# Altium project SmartPower.PrjPcb (part 1 of 2)
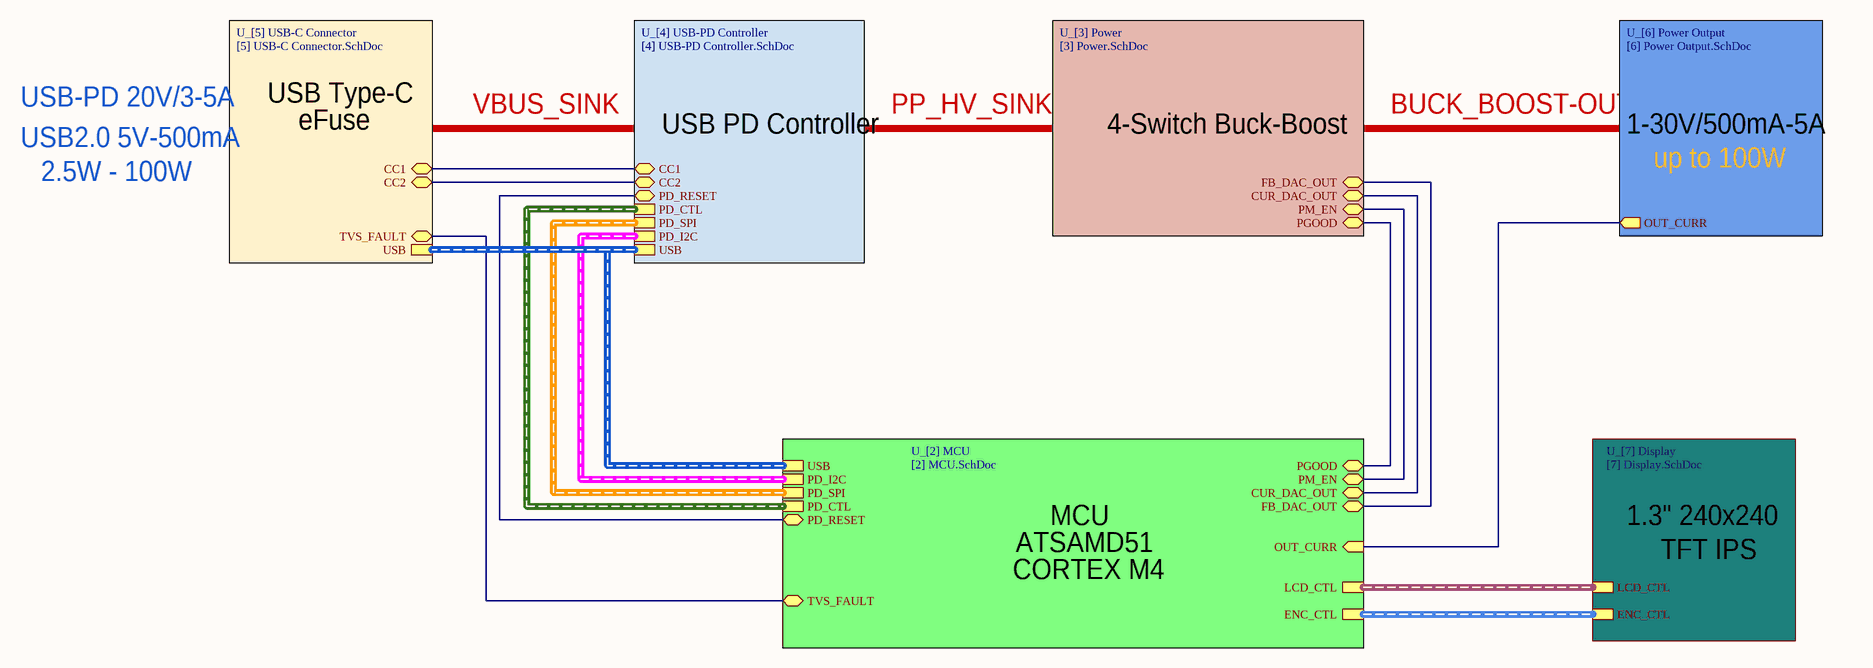
[diagram p0: [1] Block Diagram.SchDoc]
7 sheets, 117 parts. Net scope: hierarchical (ports join the sheet entries above them; power ports are global).
Board file: SmartPower.PcbDoc
Sheets:
  [1] Block Diagram.SchDoc
    U_[2] MCU = [2] MCU.SchDoc
    U_[5] USB-C Connector = [5] USB-C Connector.SchDoc
    U_[7] Display = [7] Display.SchDoc
    U_[4] USB-PD Controller = [4] USB-PD Controller.SchDoc
    U_[3] Power = [3] Power.SchDoc
    U_[6] Power Output = [6] Power Output.SchDoc

## Sheet [1] Block Diagram.SchDoc: Block Diagram - SmartPower
size A3; Author: Caner ALP; Organization: ALP Electronics; Address1: Axel Oxenstiernas; Address2: Västerås; Address3: 72478; Address4: Sweden; DocumentNumber: 1; Revision: P0.1; SheetNumber: 1; SheetTotal: 7

### Sub-sheets
U_[2] MCU = [2] MCU.SchDoc: PM_EN (bidir), CUR_DAC_OUT (bidir), PD_I2C (harness PD_I2C_H), USB (harness USB_H), PGOOD (bidir), PD_RESET (bidir), PD_CTL (harness PD_H), TVS_FAULT (bidir), FB_DAC_OUT (bidir), PD_SPI (harness PD_SPI_H), ENC_CTL (harness ENCODER), LCD_CTL (harness LCD), OUT_CURR (in)
U_[3] Power = [3] Power.SchDoc: FB_DAC_OUT (bidir), CUR_DAC_OUT (bidir), PM_EN (bidir), PGOOD (bidir)
U_[4] USB-PD Controller = [4] USB-PD Controller.SchDoc: PD_RESET (bidir), PD_CTL (harness PD_H), PD_SPI (harness PD_SPI_H), USB (harness USB_H), PD_I2C (harness PD_I2C_H), CC2 (bidir), CC1 (bidir)
U_[5] USB-C Connector = [5] USB-C Connector.SchDoc: USB (harness USB_H), TVS_FAULT (bidir), CC1 (bidir), CC2 (bidir)
U_[6] Power Output = [6] Power Output.SchDoc: OUT_CURR (out)
U_[7] Display = [7] Display.SchDoc: LCD_CTL (harness LCD), ENC_CTL (harness ENCODER)

### Nets
CC1: sheet U_[5] USB-C Connector/CC1, sheet U_[4] USB-PD Controller/CC1
CC2: sheet U_[5] USB-C Connector/CC2, sheet U_[4] USB-PD Controller/CC2
CUR_DAC_OUT: sheet U_[2] MCU/CUR_DAC_OUT, sheet U_[3] Power/CUR_DAC_OUT
FB_DAC_OUT: sheet U_[2] MCU/FB_DAC_OUT, sheet U_[3] Power/FB_DAC_OUT
OUT_CURR: sheet U_[2] MCU/OUT_CURR, sheet U_[6] Power Output/OUT_CURR
PD_RESET: sheet U_[2] MCU/PD_RESET, sheet U_[4] USB-PD Controller/PD_RESET
PGOOD: sheet U_[2] MCU/PGOOD, sheet U_[3] Power/PGOOD
PM_EN: sheet U_[2] MCU/PM_EN, sheet U_[3] Power/PM_EN
TVS_FAULT: sheet U_[2] MCU/TVS_FAULT, sheet U_[5] USB-C Connector/TVS_FAULT

### Buses and harness runs
harness sheet U_[2] MCU/ENC_CTL = sheet U_[7] Display/ENC_CTL
harness sheet U_[2] MCU/LCD_CTL = sheet U_[7] Display/LCD_CTL
harness sheet U_[2] MCU/PD_CTL = sheet U_[4] USB-PD Controller/PD_CTL
harness sheet U_[2] MCU/PD_I2C = sheet U_[4] USB-PD Controller/PD_I2C
harness sheet U_[2] MCU/PD_SPI = sheet U_[4] USB-PD Controller/PD_SPI
harness sheet U_[2] MCU/USB = sheet U_[4] USB-PD Controller/USB = sheet U_[5] USB-C Connector/USB

### Notes on the sheet
- USB-PD 20V/3-5A
- USB Type-C
- VBUS_SINK
- PP_HV_SINK
- BUCK_BOOST-OUT
- USB2.0 5V-500mA
- 2.5W - 100W
- eFuse
- USB PD Controller
- 4-Switch Buck-Boost
- 1-30V/500mA-5A
- up to 100W
- MCU
- 1.3" 240x240
- CORTEX M4
- ATSAMD51
- TFT IPS
- Title
- Size:
- Project
- A3
- Revision:
- Date:
- Sheet
- of

## Sheet [2] MCU.SchDoc
size A3; Author: Caner ALP; Organization: ALP Electronics; Address1: Axel Oxenstiernas; Address2: Västerås; Address3: 72478; Address4: Sweden; DocumentNumber: 2; SheetNumber: 2; SheetTotal: 7
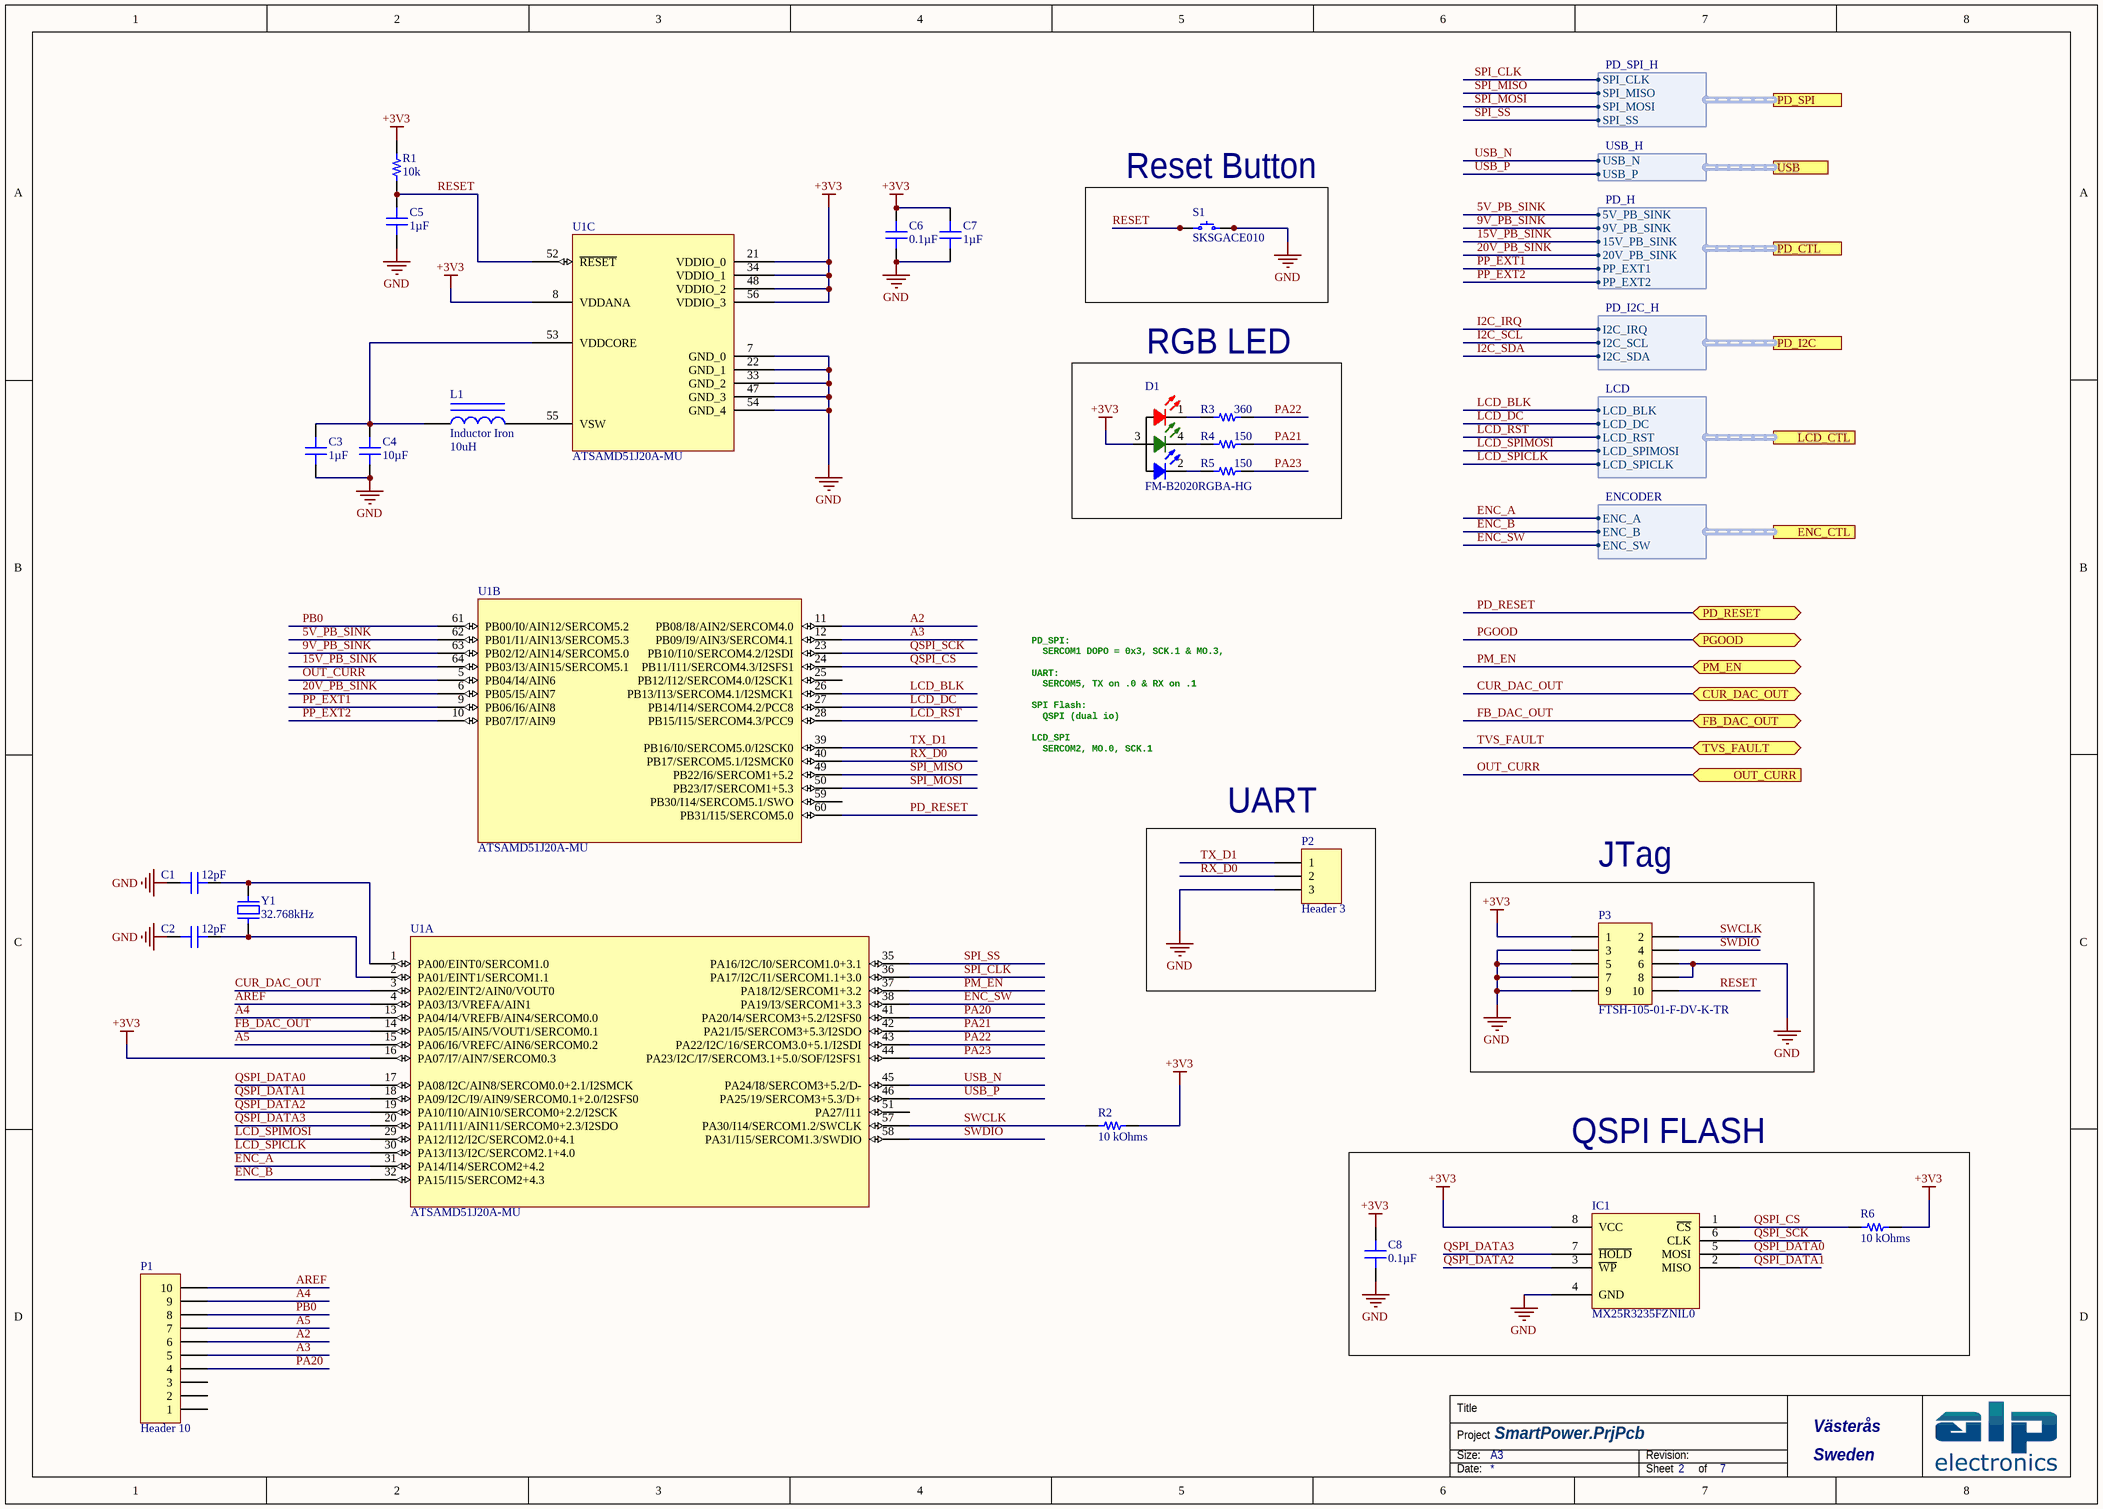
[diagram p1: [2] MCU.SchDoc]

### Parts
C1  12pF  [CAP 0603_1608]
C2  12pF  [CAP 0603_1608]
C3  1µF  [CAP 0603_1608]
C4  10µF  [CAP 0603_1608]
C5  1µF  [CAP 0603_1608]
C6  0.1µF  [CAP 0603_1608]
C7  1µF  [CAP 0603_1608]
C8  0.1µF  [CAP 0603_1608]
D1  FM-B2020RGBA-HG  [FM-B2020RGBA-HG]
IC1  MX25R3235FZNIL0  [SPANSION WSON-8 6x5MM]
L1  Inductor Iron  value 10uH  [IND_Würth_74404020100]
P1  Header 10  [HDR1X10]
P2  Header 3  [HDR1X3]
P3  FTSH-105-01-F-DV-K-TR  [FTSH-105-01-F-DV-K-TR]
R1  10k  [RES 0603/1608]
R2  10 kOhms  [RES 0603_1608]
R3  360  [RES 0603/1608]
R4  150  [RES 0603/1608]
R5  150  [RES 0603/1608]
R6  10 kOhms  [RES 0603_1608]
S1  SKSGACE010  [SKSGACE010]
U1  ATSAMD51J20A-MU  [SI LABS QFN-64_S]  (parts A,B,C of 3)
Y1  32.768kHz  [ABRACON ABS07]

### Blocks framed on the sheet
Reset Button: S1
RGB LED: D1 R3-R5
UART: P2
JTag: P3
QSPI FLASH: C8 IC1 R6

### Ports
CUR_DAC_OUT (bidir), ENC_CTL (harness ENCODER), FB_DAC_OUT (bidir), LCD_CTL (harness LCD), OUT_CURR (in), PD_CTL (harness PD_H), PD_I2C (harness PD_I2C_H), PD_RESET (bidir), PD_SPI (harness PD_SPI_H), PGOOD (bidir), PM_EN (bidir), TVS_FAULT (bidir), USB (harness USB_H)

### Harnesses
USB_H: USB_N, USB_P
PD_H: 5V_PB_SINK, 9V_PB_SINK, 15V_PB_SINK, 20V_PB_SINK, PP_EXT1, PP_EXT2
PD_SPI_H: SPI_CLK, SPI_MISO, SPI_MOSI, SPI_SS
PD_I2C_H: I2C_IRQ, I2C_SCL, I2C_SDA
LCD: LCD_BLK, LCD_DC, LCD_RST, LCD_SPIMOSI, LCD_SPICLK
ENCODER: ENC_A, ENC_B, ENC_SW

### Nets
+3V3: C6.1 C7.2 C8.1 D1.3 IC1.8(VCC) P3.1 R1.2 R2.2 R6.2 U1.8(VDDANA) U1.16(PA07/I7/AIN7/SERCOM0.3) U1.21(VDDIO_0) U1.34(VDDIO_1) U1.48(VDDIO_2) U1.56(VDDIO_3)
GND: C1.1 C2.1 C3.1 C4.1 C5.1 C6.2 C7.1 C8.2 IC1.4(GND) P2.3 P3.3 P3.5 P3.6 P3.7 P3.8 P3.9 S1.3 S1.4 U1.7(GND_0) U1.22(GND_1) U1.33(GND_2) U1.47(GND_3) U1.54(GND_4)
5V_PB_SINK: U1.62(PB01/I1/AIN13/SERCOM5.3) ; port PD_CTL.5V_PB_SINK
9V_PB_SINK: U1.63(PB02/I2/AIN14/SERCOM5.0) ; port PD_CTL.9V_PB_SINK
15V_PB_SINK: U1.64(PB03/I3/AIN15/SERCOM5.1) ; port PD_CTL.15V_PB_SINK
20V_PB_SINK: U1.6(PB05/I5/AIN7) ; port PD_CTL.20V_PB_SINK
A2: P1.6 U1.11(PB08/I8/AIN2/SERCOM4.0)
A3: P1.5 U1.12(PB09/I9/AIN3/SERCOM4.1)
A4: P1.9 U1.13(PA04/I4/VREFB/AIN4/SERCOM0.0)
A5: P1.7 U1.15(PA06/I6/VREFC/AIN6/SERCOM0.2)
AREF: P1.10 U1.4(PA03/I3/VREFA/AIN1)
CUR_DAC_OUT: U1.3(PA02/EINT2/AIN0/VOUT0) ; port CUR_DAC_OUT
ENC_A: U1.31(PA14/I14/SERCOM2+4.2) ; port ENC_CTL.ENC_A
ENC_B: U1.32(PA15/I15/SERCOM2+4.3) ; port ENC_CTL.ENC_B
ENC_SW: U1.38(PA19/I3/SERCOM1+3.3) ; port ENC_CTL.ENC_SW
FB_DAC_OUT: U1.14(PA05/I5/AIN5/VOUT1/SERCOM0.1) ; port FB_DAC_OUT
LCD_BLK: U1.26(PB13/I13/SERCOM4.1/I2SMCK1) ; port LCD_CTL.LCD_BLK
LCD_DC: U1.27(PB14/I14/SERCOM4.2/PCC8) ; port LCD_CTL.LCD_DC
LCD_RST: U1.28(PB15/I15/SERCOM4.3/PCC9) ; port LCD_CTL.LCD_RST
LCD_SPICLK: U1.30(PA13/I13/I2C/SERCOM2.1+4.0) ; port LCD_CTL.LCD_SPICLK
LCD_SPIMOSI: U1.29(PA12/I12/I2C/SERCOM2.0+4.1) ; port LCD_CTL.LCD_SPIMOSI
OUT_CURR: U1.5(PB04/I4/AIN6) ; port OUT_CURR
PA20: P1.4 U1.41(PA20/I4/SERCOM3+5.2/I2SFS0)
PA21: R4.2 U1.42(PA21/I5/SERCOM3+5.3/I2SDO)
PA22: R3.2 U1.43(PA22/I2C/16/SERCOM3.0+5.1/I2SDI)
PA23: R5.2 U1.44(PA23/I2C/I7/SERCOM3.1+5.0/SOF/I2SFS1)
PB0: P1.8 U1.61(PB00/I0/AIN12/SERCOM5.2)
PD_RESET: U1.60(PB31/I15/SERCOM5.0) ; port PD_RESET
PM_EN: U1.37(PA18/I2/SERCOM1+3.2) ; port PM_EN
PP_EXT1: U1.9(PB06/I6/AIN8) ; port PD_CTL.PP_EXT1
PP_EXT2: U1.10(PB07/I7/AIN9) ; port PD_CTL.PP_EXT2
QSPI_CS: IC1.1(~{CS}) R6.1 U1.24(PB11/I11/SERCOM4.3/I2SFS1)
QSPI_DATA0: IC1.5(MOSI) U1.17(PA08/I2C/AIN8/SERCOM0.0+2.1/I2SMCK)
QSPI_DATA1: IC1.2(MISO) U1.18(PA09/I2C/I9/AIN9/SERCOM0.1+2.0/I2SFS0)
QSPI_DATA2: IC1.3(~{WP}) U1.19(PA10/I10/AIN10/SERCOM0+2.2/I2SCK)
QSPI_DATA3: IC1.7(~{HOLD}) U1.20(PA11/I11/AIN11/SERCOM0+2.3/I2SDO)
QSPI_SCK: IC1.6(CLK) U1.23(PB10/I10/SERCOM4.2/I2SDI)
RESET: C5.2 P3.10 R1.1 S1.1 S1.2 U1.52(~{RESET})
RX_D0: P2.2 U1.40(PB17/SERCOM5.1/I2SMCK0)
SPI_CLK: U1.36(PA17/I2C/I1/SERCOM1.1+3.0) ; port PD_SPI.SPI_CLK
SPI_MISO: U1.49(PB22/I6/SERCOM1+5.2) ; port PD_SPI.SPI_MISO
SPI_MOSI: U1.50(PB23/I7/SERCOM1+5.3) ; port PD_SPI.SPI_MOSI
SPI_SS: U1.35(PA16/I2C/I0/SERCOM1.0+3.1) ; port PD_SPI.SPI_SS
SWCLK: P3.2 R2.1 U1.57(PA30/I14/SERCOM1.2/SWCLK)
SWDIO: P3.4 U1.58(PA31/I15/SERCOM1.3/SWDIO)
TX_D1: P2.1 U1.39(PB16/I0/SERCOM5.0/I2SCK0)
USB_N: U1.45(PA24/I8/SERCOM3+5.2/D-) ; port USB.USB_N
USB_P: U1.46(PA25/19/SERCOM3+5.3/D+) ; port USB.USB_P
NetC1_2: C1.2 U1.1(PA00/EINT0/SERCOM1.0) Y1.2
NetC2_2: C2.2 U1.2(PA01/EINT1/SERCOM1.1) Y1.1
NetC3_2: C3.2 C4.2 L1.1 U1.53(VDDCORE)
NetD1_1: D1.1 R3.1
NetD1_2: D1.2 R5.1
NetD1_4: D1.4 R4.1
NetL1_2: L1.2 U1.55(VSW)

Not connected (* = marked no-connect by the designer): P1 1 2 3; U1 25(PB12/I12/SERCOM4.0/I2SCK1) 51(PA27/I11) 59(PB30/I14/SERCOM5.1/SWO)

### Notes on the sheet
- PD_SPI:
  SERCOM1 DOPO = 0x3, SCK.1 & MO.3,
  UART:
  SERCOM5, TX on .0 & RX on .1
  SPI Flash:
  QSPI (dual io)
  LCD_SPI
  SERCOM2, MO.0, SCK.1
- Title
- Size:
- Project
- A3
- Revision:
- Date:
- Sheet
- of

### Library data of the parts
C1 C2 = 06031A120JAT4A: CAP CER 12PF 100V NP0 0603; Manufacturer: AVX Corporation; Temperature Coefficient: C0G, NP0; Tolerance: ±5%; Part Number: 06031A120JAT4A; Value: 12pF; Applications: General Purpose; Capacitance: 12pF; ComponentLink1Description: Datasheet; ComponentLink1URL: http://datasheets.avx.com/C0GNP0-Dielectric.pdf; ComponentLink2Description: DigiKey Link; ComponentLink2URL: http://digikey.com/product-detail/en/avx-corporation/06031A120JAT4A/478-10188-1-ND/6797488; Device Package: 0603 (1608 Metric); LastUpdated: 21/01/2020 00:01:49; Lifecycle Status: Active; Minimum Order: 1; Mounting Type: Surface Mount, MLCC; Operating Temperature: -55°C ~ 125°C; Package / Case: 0603 (1608 Metric); Packaging: TapeAndReel; PartId: 14161; Part Status: Active; Price: 0.01; Series: -; Size / Dimension: 0.063" L x 0.032" W (1.60mm x 0.81mm); Supplier 1: DigiKey; Supplier Part Number 1: 478-10188-1-ND; Thickness (Max): 0.035" (0.90mm); Voltage - Rated: 100V
C3 C5 = 06035C105KAT2A: CAP CER 1UF 50V X7R 0603; Manufacturer: AVX Corporation; Tolerance: ±10%; Part Number: 06035C105KAT2A; Value: 1µF; Applications: General Purpose; Capacitance: 1µF; ComponentLink1Description: Datasheet; ComponentLink1URL: http://datasheets.avx.com/X7RDielectric.pdf; ComponentLink2Description: DigiKey Link; ComponentLink2URL: http://digikey.com/product-detail/en/avx-corporation/06035C105KAT2A/478-10073-1-ND/6564295; Device Package: 0603 (1608 Metric); LastUpdated: 21/01/2020 00:02:08; Lifecycle Status: Active; Minimum Order: 1; Mounting Type: Surface Mount, MLCC; Operating Temperature: -55°C ~ 125°C; Package / Case: 0603 (1608 Metric); Packaging: TapeAndReel; PartId: 2905; Part Status: Active; Price: 0.15; Series: -; Size / Dimension: 0.063" L x 0.032" W (1.60mm x 0.81mm); Supplier 1: DigiKey; Supplier Part Number 1: 478-10073-1-ND; Temperature Coefficient: X7R; Thickness (Max): 0.020" (0.50mm); Voltage - Rated: 50V
C4 = 0603ZD106MAT2A: CAP CER 10UF 10V X5R 0603; Manufacturer: AVX Corporation; Tolerance: ±20%; Part Number: 0603ZD106MAT2A; Value: 10µF; Applications: General Purpose; Capacitance: 10µF; ComponentLink1Description: Datasheet; ComponentLink1URL: http://datasheets.avx.com/cx5r.pdf; ComponentLink2Description: DigiKey Link; ComponentLink2URL: http://digikey.com/product-detail/en/avx-corporation/0603ZD106MAT2A/478-8050-1-ND/3900666; Device Package: 0603 (1608 Metric); LastUpdated: 21/01/2020 00:01:55; Lifecycle Status: Active; Minimum Order: 1; Mounting Type: Surface Mount, MLCC; Operating Temperature: -55°C ~ 85°C; Package / Case: 0603 (1608 Metric); Packaging: TapeAndReel; PartId: 11464; Part Status: Active; Price: 0.18; Series: -; Size / Dimension: 0.063" L x 0.032" W (1.60mm x 0.81mm); Supplier 1: DigiKey; Supplier Part Number 1: 478-8050-1-ND; Temperature Coefficient: X5R; Thickness (Max): 0.035" (0.90mm); Voltage - Rated: 10V
C6 C8 = 0603BB104K500NGT: CAP CER 0.1UF 50V X7R 0603; Manufacturer: Knowles Novacap; Tolerance: ±10%; Part Number: 0603BB104K500NGT; Value: 0.1µF; Applications: General Purpose; Capacitance: 0.1µF; ComponentLink1Description: Datasheet; ComponentLink1URL: https://www.knowlescapacitors.com/getattachment/6c8d48ef-fc2b-4752-ae2c-ce6c208de0c4/High-Capacitance-Chip.aspx; ComponentLink2Description: DigiKey Link; ComponentLink2URL: http://digikey.com/product-detail/en/knowles-novacap/0603BB104K500NGT/1763-1146-1-ND/7304094; Device Package: 0603 (1608 Metric); Features: Gold Flash Termination; LastUpdated: 21/01/2020 00:02:02; Lifecycle Status: Active; Minimum Order: 1; Mounting Type: Surface Mount, MLCC; Operating Temperature: -55°C ~ 125°C; Package / Case: 0603 (1608 Metric); Packaging: TapeAndReel; PartId: 7006; Part Status: Active; Price: 0.56; Series: -; Size / Dimension: 0.060" L x 0.030" W (1.52mm x 0.76mm); Supplier 1: DigiKey; Supplier Part Number 1: 1763-1146-1-ND; Temperature Coefficient: X7R; Thickness (Max): 0.035" (0.89mm); Voltage - Rated: 50V
C7 = 0603BB105K160YT: CAP CER 1UF 16V X7R 0603; Manufacturer: Knowles Novacap; Tolerance: ±10%; Part Number: 0603BB105K160YT; Value: 1µF; Applications: General Purpose; Capacitance: 1µF; ComponentLink1Description: Datasheet; ComponentLink1URL: https://www.knowlescapacitors.com/getattachment/6c8d48ef-fc2b-4752-ae2c-ce6c208de0c4/High-Capacitance-Chip.aspx; ComponentLink2Description: DigiKey Link; ComponentLink2URL: http://digikey.com/product-detail/en/knowles-novacap/0603BB105K160YT/1763-1175-1-ND/7304294; Device Package: 0603 (1608 Metric); LastUpdated: 21/01/2020 00:02:02; Lifecycle Status: Active; Minimum Order: 1; Mounting Type: Surface Mount, MLCC; Operating Temperature: -55°C ~ 125°C; Package / Case: 0603 (1608 Metric); Packaging: TapeAndReel; PartId: 6996; Part Status: Active; Price: 0.51; Series: -; Size / Dimension: 0.060" L x 0.030" W (1.52mm x 0.76mm); Supplier 1: DigiKey; Supplier Part Number 1: 1763-1175-1-ND; Temperature Coefficient: X7R; Thickness (Max): 0.035" (0.89mm); Voltage - Rated: 16V
D1 = FM-B2020RGBA-HG: RGB 615~630nmRed,515~535nmGreen,465~480nmBlue 2020; Manufacturer: Foshan NationStar Optoelectronics; Value: Green; Type: Surface Mount; Part Number: FM-B2020RGBA-HG; PartId: 10872; Supplier 1: LCSC; Supplier Part Number 1: C108793; ComponentLink1Description: Datasheet; ComponentLink1URL: https://datasheet.lcsc.com/szlcsc/1810231210_Foshan-NationStar-Optoelectronics-FM-B2020RGBA-HG_C108793.pdf; ComponentLink2Description: LCSC Listing; ComponentLink2URL: https://lcsc.com/product-detail/Light-Emitting-Diodes-LED_FM-B2020RGBA-HG_C108793.html; Device Package: 2020; Colour: RGB
IC1 = S25FL116K0XNFI011: IC FLASH MEM 16MB SPI CMOS 8WSON; Manufacturer: Spansion; Memory Type: FLASH - NOR; Memory Size: 16M (2M x 8); Speed: 108MHz; Interface: SPI Serial; Voltage - Supply: 2.7 V ~ 3.6 V; Part Number: S25FL116K0XNFI011; PartId: 8258; Supplier 1: Digi-Key; Supplier Part Number 1: 1274-1131-ND; ComponentLink1Description: Datasheet; ComponentLink1URL: http://www.spansion.com/Support/Datasheets/S25FL1-K_00.pdf; ComponentLink2Description: Digi-Key Listing; ComponentLink2URL: http://www.digikey.com/product-detail/en/S25FL116K0XNFI011/1274-1131-ND/4517162; Price: 0,49; Type: FLASH - NOR; Device Package: 8-WDFN Exposed Pad; Operating Temperature: -40C ~ 85C
L1 = Inductor Iron: Magnetic-Core Inductor; Published: 24-Mar-1999; LatestRevisionDate: 17-Jul-2002; LatestRevisionNote: Re-released for DXP Platform.; PackageReference: AXIAL-0.9; Publisher: Altium Limited; PackageDescription: Axial Device, Thru-Hole; 2 Leads; 0.9 in Pin Spacing
P1 = Header 10: Header, 10-Pin; LatestRevisionDate: 17-Jul-2002; LatestRevisionNote: Re-released for DXP Platform.; Publisher: Altium Limited
P2 = Header 3: Header, 3-Pin; LatestRevisionDate: 17-Jul-2002; LatestRevisionNote: Re-released for DXP Platform.; Publisher: Altium Limited
P3 = Header 5X2: Header, 5-Pin, Dual row; LatestRevisionDate: 17-Jul-2002; LatestRevisionNote: Re-released for DXP Platform.; Publisher: Altium Limited
R1 = ERJ-3GEYJ103V: RES SMD 10K OHM 5% 1/10W 0603; Manufacturer: Panasonic Electronic Components; TemperatureRange: -55C ~ 155C; TemperatureCoefficient: 200ppm/C; PowerRating: 0.1W, 1/10W; Value: 10k; Part Number: ERJ-3GEYJ103V; PartId: 11175; Supplier 1: Digi-Key; Supplier Part Number 1: P10KGTR-ND; ComponentLink1Description: Datasheet; ComponentLink1URL: http://industrial.panasonic.com/www-cgi/jvcr13pz.cgi?E+PZ+3+AOA0001+ERJ3GEYJ103V+7+WW; ComponentLink2Description: Digi-Key Listing; ComponentLink2URL: https://www.digikey.com/product-detail/en/panasonic-electronic-components/ERJ-3GEYJ103V/P10KGTR-ND/135662; Tolerance: 5%; Price: 0.002; Device Package: 0603 (1608 Metric)
R2 R6 = CRCW060310K0JNEA: RES SMD 10K OHM 5% 1/10W 0603; Manufacturer: Vishay Dale; Power (Watts): 0.1W, 1/10W; Temperature Coefficient: ±200ppm/°C; Part Number: CRCW060310K0JNEA; Value: 10 kOhms; ComponentLink1Description: Datasheet; ComponentLink1URL: http://www.vishay.com/docs/20035/dcrcwe3.pdf; ComponentLink2Description: DigiKey Link; ComponentLink2URL: http://digikey.com/product-detail/en/vishay-dale/CRCW060310K0JNEA/541-10KGCT-ND/1179393; Composition: Thick Film; Device Package: 0603 (1608 Metric); Features: Automotive AEC-Q200; Height - Seated (Max): 0.020" (0.50mm); LastUpdated: 21/01/2020 00:24:50; Lifecycle Status: Active; Minimum Order: 1; Number of Terminations: 2; Operating Temperature: -55°C ~ 155°C; Package / Case: 0603 (1608 Metric); Packaging: CutTape; PartId: 5216; Part Status: Active; Price: 0.10; Ratings: AEC-Q200; Resistance: 10 kOhms; Series: CRCW; Size / Dimension: 0.063" L x 0.033" W (1.60mm x 0.85mm); Supplier 1: DigiKey; Supplier Part Number 1: 541-10KGCT-ND; Supplier Device Package: 0603; Tolerance: ±5%
R3 = ERJ-3GEYJ361V: RES SMD 360 OHM 5% 1/10W 0603; Manufacturer: Panasonic Electronic Components; TemperatureRange: -55C ~ 155C; TemperatureCoefficient: 200ppm/C; PowerRating: 0.1W, 1/10W; Value: 360; Part Number: ERJ-3GEYJ361V; PartId: 11239; Supplier 1: Digi-Key; Supplier Part Number 1: P360GTR-ND; ComponentLink1Description: Datasheet; ComponentLink1URL: http://industrial.panasonic.com/www-cgi/jvcr13pz.cgi?E+PZ+3+AOA0001+ERJ3GEYJ361V+7+WW; ComponentLink2Description: Digi-Key Listing; ComponentLink2URL: https://www.digikey.com/product-detail/en/panasonic-electronic-components/ERJ-3GEYJ361V/P360GTR-ND/135761; Tolerance: 5%; Price: 0.002; Device Package: 0603 (1608 Metric)
R4 R5 = ERJ-3GEYJ151V: RES SMD 150 OHM 5% 1/10W 0603; Manufacturer: Panasonic Electronic Components; TemperatureRange: -55C ~ 155C; TemperatureCoefficient: 200ppm/C; PowerRating: 0.1W, 1/10W; Value: 150; Part Number: ERJ-3GEYJ151V; PartId: 11200; Supplier 1: Digi-Key; Supplier Part Number 1: P150GTR-ND; ComponentLink1Description: Datasheet; ComponentLink1URL: http://industrial.panasonic.com/www-cgi/jvcr13pz.cgi?E+PZ+3+AOA0001+ERJ3GEYJ151V+7+WW; ComponentLink2Description: Digi-Key Listing; ComponentLink2URL: https://www.digikey.com/product-detail/en/panasonic-electronic-components/ERJ-3GEYJ151V/P150GTR-ND/135689; Tolerance: 5%; Price: 0.002; Device Package: 0603 (1608 Metric)
S1 = SKSGACE010: SWITCH TACTILE SPST-NO 0.05A 16V; Manufacturer: ALPS; Part Number: SKSGACE010; PartId: 16471; Supplier 1: Mouser; Supplier Part Number 1: 688-SKSGACE010; ComponentLink1Description: Datasheet; ComponentLink1URL: https://www.mouser.se/datasheet/2/15/SKSG-1370727.pdf; ComponentLink2Description: Mouser Listing; ComponentLink2URL: https://www.mouser.se/ProductDetail/ALPS/SKSGACE010?qs=Ptl%2FSkKmb3BEFq%252BG855%2Fog==
U1 = ATSAMD51J20A-MU: IC MCU 32BIT 1MB FLASH 64VQFN; Manufacturer: Microchip Technology; Core Processor: ARM Cortex-M4; Part Number: ATSAMD51J20A-MU; PartId: 10980; Supplier 1: Digi-Key; Supplier Part Number 1: ATSAMD51J20A-MU-ND; ComponentLink1Description: Datasheet; ComponentLink1URL: http://ww1.microchip.com/downloads/en/DeviceDoc/60001507E.pdf; ComponentLink2Description: Digi-Key Listing; ComponentLink2URL: https://www.digikey.com/product-detail/en/microchip-technology/ATSAMD51J20A-MU/ATSAMD51J20A-MU-ND/7390352; Device Package: 64-VFQFN Exposed Pad
Y1 = ABS07-32.768KHZ-T: CRYSTAL 32.7680KHZ 12.5PF SMD; Manufacturer: Abracon LLC; Frequency Tolerance: 20ppm; ESR: 70 kOhm; Operating Mode: Fundamental; Part Number: ABS07-32.768KHZ-T; PartId: 8487; Supplier 1: Digi-Key; Supplier Part Number 1: 535-9542-2-ND; ComponentLink1Description: Datasheet; ComponentLink1URL: http://www.abracon.com/Resonators/ABS07.pdf; ComponentLink2Description: Digi-Key Listing; ComponentLink2URL: http://www.digikey.com/product-detail/en/ABS07-32.768KHZ-T/535-9542-2-ND/1236858; Price: 0,3; Type: kHz Crystal (Tuning Fork); Device Package: 2-SMD; Frequency: 32.768kHz; Frequency Stability: -; Load Capacitance: 12.5pF

## Sheet [5] USB-C Connector.SchDoc: Power IN - USB-C
size A3; Author: Caner ALP; CompanyName: ALP Electronics; DrawnBy: Caner Alp; Engineer: Caner Alp; Organization: ALP Electronics; Address1: Axel Oxenstiernas; Address2: Västerås; Address3: 72478; Address4: Sweden; DocumentNumber: 5; SheetNumber: 5; SheetTotal: 7
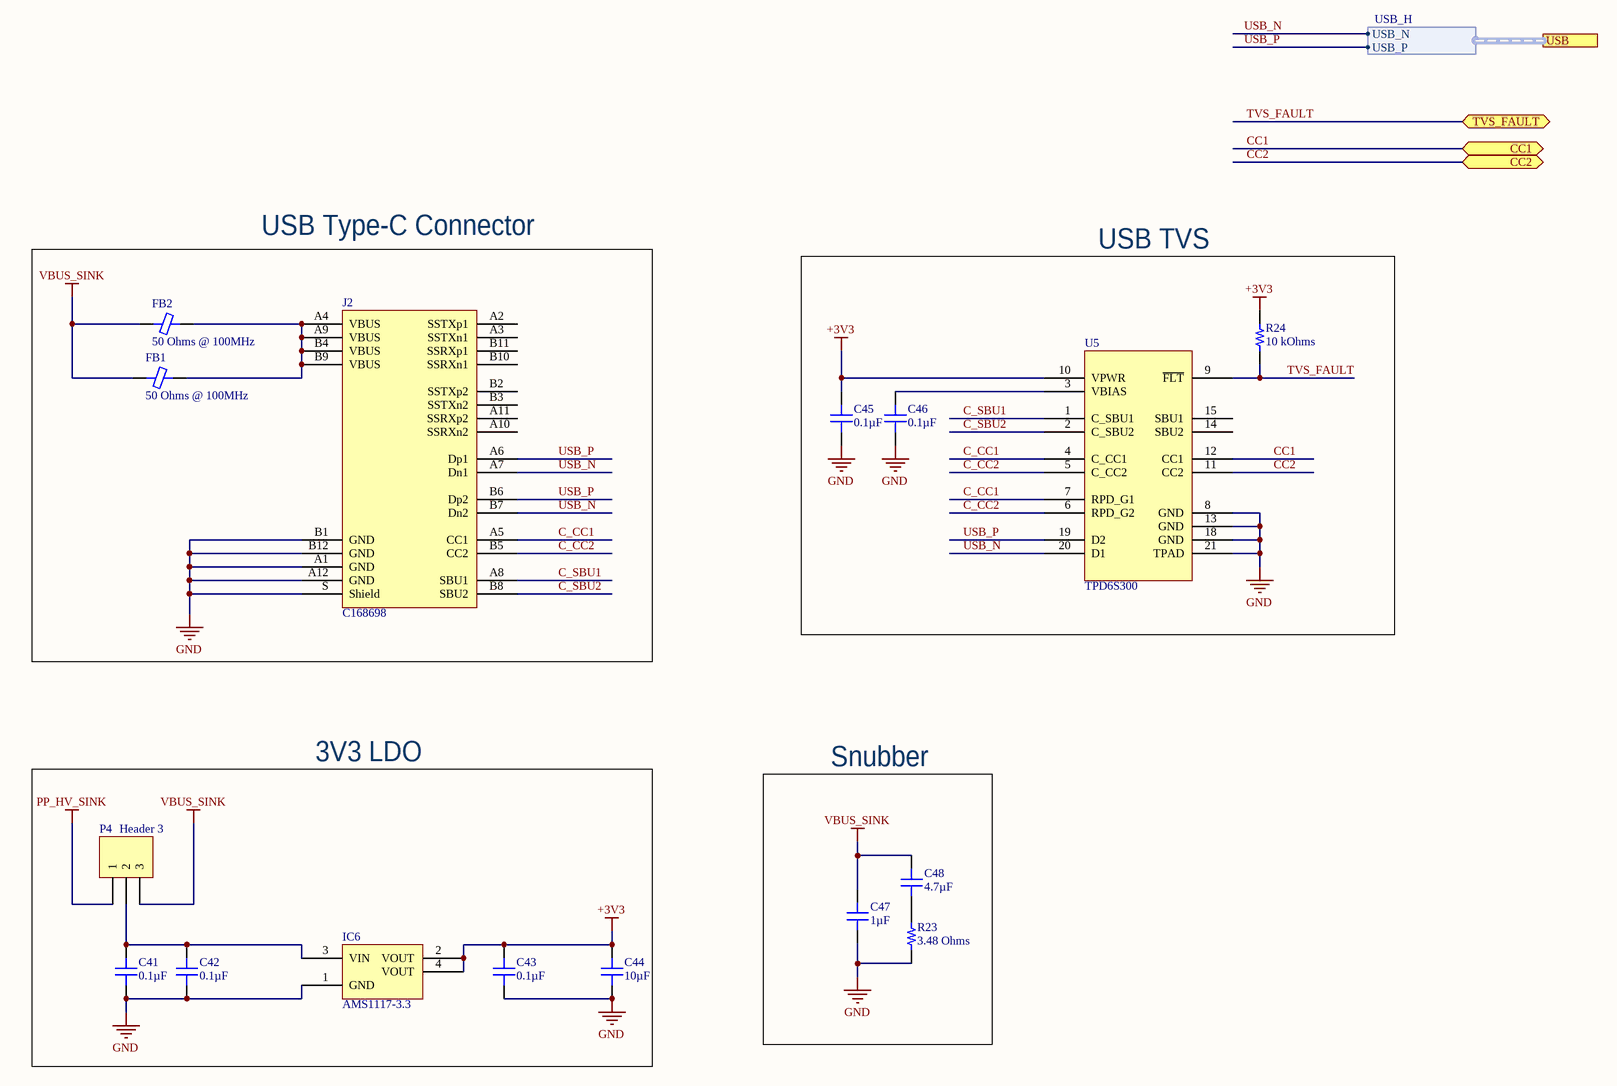
[diagram p2: [5] USB-C Connector.SchDoc]

### Parts
C41  0.1µF  [CAP 0805_2012]
C42  0.1µF  [CAP 0805_2012]
C43  0.1µF  [CAP 0805_2012]
C44  10µF  [CAP 1210_3225 - 2.8MM]
C45  0.1µF  [CAP 0603_1608]
C46  0.1µF  [CAP 0603_1608]
C47  1µF  [CAP 0805_2012]
C48  4.7µF  [CAP 0805_2012]
FB1  50 Ohms @ 100MHz  [FER 1206_3216]
FB2  50 Ohms @ 100MHz  [FER 1206_3216]
IC6  AMS1117-3.3  [ON SEMI SOT-223 ST(318H)]
J2  C168698  [USB4055]
P4  Header 3  [HEADER 2.54MM - duplicate1]
R23  3.48 Ohms  [RES 0805_2012]
R24  10 kOhms  [RES 0603_1608]
U5  TPD6S300  [WQFN - 20]

### Blocks framed on the sheet
USB Type-C Connector: FB1 FB2 J2
USB TVS: C45 C46 R24 U5
3V3 LDO: C41-C44 IC6 P4
Snubber: C47 C48 R23

### Ports
CC1 (bidir), CC2 (bidir), TVS_FAULT (bidir), USB (harness USB_H)

### Harnesses
USB_H: USB_N, USB_P

### Nets
+3V3: C43.2 C44.2 C45.2 IC6.2(VOUT) IC6.4(VOUT) R24.1 U5.10(VPWR)
GND: C41.1 C42.1 C43.1 C44.1 C45.1 C46.1 C47.1 IC6.1(GND) J2.A1(GND) J2.A12(GND) J2.B1(GND) J2.B12(GND) J2.S(Shield) R23.1 U5.8(GND) U5.13(GND) U5.18(GND) U5.21(TPAD)
PP_HV_SINK: P4.1
VBUS_SINK: C47.2 C48.1 FB1.1 FB2.1 P4.3
C_CC1: J2.A5(CC1) U5.4(C_CC1) U5.7(RPD_G1)
C_CC2: J2.B5(CC2) U5.5(C_CC2) U5.6(RPD_G2)
C_SBU1: J2.A8(SBU1) U5.1(C_SBU1)
C_SBU2: J2.B8(SBU2) U5.2(C_SBU2)
CC1: U5.12(CC1) ; port CC1
CC2: U5.11(CC2) ; port CC2
TVS_FAULT: R24.2 U5.9(~{FLT}) ; port TVS_FAULT
USB_N: J2.A7(Dn1) J2.B7(Dn2) U5.20(D1) ; port USB.USB_N
USB_P: J2.A6(Dp1) J2.B6(Dp2) U5.19(D2) ; port USB.USB_P
NetC41_2: C41.2 C42.2 IC6.3(VIN) P4.2
NetC46_2: C46.2 U5.3(VBIAS)
NetC48_2: C48.2 R23.2
NetFB1_2: FB1.2 FB2.2 J2.A4(VBUS) J2.A9(VBUS) J2.B4(VBUS) J2.B9(VBUS)

Not connected (* = marked no-connect by the designer): J2 A2(SSTXp1) A3(SSTXn1) A10(SSRXn2) A11(SSRXp2) B2(SSTXp2) B3(SSTXn2) B10(SSRXn1) B11(SSRXp1); U5 14(SBU2) 15(SBU1) 16(NC) 17(NC)

### Notes on the sheet
- Title
- Size:
- Project
- A3
- Revision:
- Date:
- Sheet
- of

### Library data of the parts
C41-C43 = 160R15W104KV4T: CAP CER 0.1UF 16V X7R 0805; Manufacturer: Johanson Dielectrics Inc.; Tolerance: ±10%; Part Number: 160R15W104KV4T; Value: 0.1µF; Applications: General Purpose; Capacitance: 0.1µF; ComponentLink1Description: Datasheet; ComponentLink1URL: https://www.johansondielectrics.com/downloads/catalog/johanson-dielectrics-product-catalog.pdf; ComponentLink2Description: DigiKey Link; ComponentLink2URL: http://digikey.com/product-detail/en/johanson-dielectrics-inc/160R15W104KV4T/709-1183-1-ND/1859515; Device Package: 0805 (2012 Metric); LastUpdated: 21/01/2020 00:02:56; Lifecycle Status: Active; Minimum Order: 1; Mounting Type: Surface Mount, MLCC; Operating Temperature: -55°C ~ 125°C; Package / Case: 0805 (2012 Metric); Packaging: TapeAndReel; PartId: 9125; Part Status: Active; Price: 0.03; Series: -; Size / Dimension: 0.080" L x 0.050" W (2.03mm x 1.27mm); Supplier 1: DigiKey; Supplier Part Number 1: 709-1183-1-ND; Temperature Coefficient: X7R; Thickness (Max): 0.050" (1.27mm); Voltage - Rated: 16V
C44 = C1210C106K3RACAUTO: CAP CER 10UF 25V X7R 1210; Manufacturer: KEMET; Tolerance: ±10%; Part Number: C1210C106K3RACAUTO; Value: 10µF; Applications: Automotive, Bypass, Decoupling; Capacitance: 10µF; ComponentLink1Description: Datasheet; ComponentLink1URL: //media.digikey.com/pdf/Data%20Sheets/Kemet%20PDFs/C1210C106K3RACAUTO.pdf; ComponentLink2Description: DigiKey Link; ComponentLink2URL: http://digikey.com/product-detail/en/kemet/C1210C106K3RACAUTO/399-7046-1-ND/3314553; Device Package: 1210 (3225 Metric); LastUpdated: 21/01/2020 00:30:50; Lifecycle Status: Active; Minimum Order: 1; Mounting Type: Surface Mount, MLCC; Operating Temperature: -55°C ~ 125°C; Package / Case: 1210 (3225 Metric); Packaging: TapeAndReel; PartId: 23626; Part Status: Active; Price: 0.22; Ratings: AEC-Q200; Series: SMD Auto X7R; Size / Dimension: 0.126" L x 0.098" W (3.20mm x 2.50mm); Supplier 1: DigiKey; Supplier Part Number 1: 399-7046-1-ND; Temperature Coefficient: X7R; Thickness (Max): 0.106" (2.70mm); Voltage - Rated: 25V
C45 C46 = 0603B104J160CT: CAP CER 0.1UF 16V X7R 0603; Manufacturer: Walsin Technology Corporation; Tolerance: ±5%; Part Number: 0603B104J160CT; Value: 0.1µF; Applications: General Purpose; Capacitance: 0.1µF; ComponentLink1Description: Datasheet; ComponentLink1URL: http://www.passivecomponent.com/wp-content/uploads/2018/10/MLCC.pdf; ComponentLink2Description: DigiKey Link; ComponentLink2URL: http://digikey.com/product-detail/en/walsin-technology-corporation/0603B104J160CT/1292-1389-1-ND/9355393; Device Package: 0603 (1608 Metric); LastUpdated: 21/01/2020 00:01:52; Lifecycle Status: Active; Minimum Order: 1; Mounting Type: Surface Mount, MLCC; Operating Temperature: -55°C ~ 125°C; Package / Case: 0603 (1608 Metric); Packaging: TapeAndReel; PartId: 13150; Part Status: Active; Price: 0.02; Series: -; Size / Dimension: 0.063" L x 0.031" W (1.60mm x 0.80mm); Supplier 1: DigiKey; Supplier Part Number 1: 1292-1389-1-ND; Temperature Coefficient: X7R; Thickness (Max): 0.034" (0.87mm); Voltage - Rated: 16V
C47 = 08055C105K4Z2A: CAP CER 1UF 50V X7R 0805; Manufacturer: AVX Corporation; Tolerance: ±10%; Part Number: 08055C105K4Z2A; Value: 1µF; Applications: Automotive, Boardflex Sensitive; Capacitance: 1µF; ComponentLink1Description: Datasheet; ComponentLink1URL: http://datasheets.avx.com/FlexitermMLCC.pdf; ComponentLink2Description: DigiKey Link; ComponentLink2URL: http://digikey.com/product-detail/en/avx-corporation/08055C105K4Z2A/478-9557-1-ND/5322895; Device Package: 0805 (2012 Metric); Features: Soft Termination; LastUpdated: 21/01/2020 00:03:05; Lifecycle Status: Active; Minimum Order: 1; Mounting Type: Surface Mount, MLCC; Operating Temperature: -55°C ~ 125°C; Package / Case: 0805 (2012 Metric); Packaging: TapeAndReel; PartId: 2983; Part Status: Active; Price: 0.09; Ratings: AEC-Q200; Series: FLEXITERM®; Size / Dimension: 0.079" L x 0.049" W (2.00mm x 1.25mm); Supplier 1: DigiKey; Supplier Part Number 1: 478-9557-1-ND; Temperature Coefficient: X7R; Thickness (Max): 0.055" (1.40mm); Voltage - Rated: 50V
C48 = C2012JB1H475K125AB: CAP CER 4.7UF 50V JB 0805; Manufacturer: TDK Corporation; Tolerance: ±10%; Part Number: C2012JB1H475K125AB; Value: 4.7µF; Applications: General Purpose; Capacitance: 4.7µF; ComponentLink1Description: Datasheet; ComponentLink1URL: https://product.tdk.com/info/en/catalog/datasheets/mlcc_commercial_general_en.pdf?ref_disty=digikey; ComponentLink2Description: DigiKey Link; ComponentLink2URL: http://digikey.com/product-detail/en/tdk-corporation/C2012JB1H475K125AB/445-11510-1-ND/3953176; Device Package: 0805 (2012 Metric); Features: Low ESL; LastUpdated: 21/01/2020 00:02:45; Lifecycle Status: Active; Minimum Order: 1; Mounting Type: Surface Mount, MLCC; Operating Temperature: -25°C ~ 85°C; Package / Case: 0805 (2012 Metric); Packaging: TapeAndReel; PartId: 15333; Part Status: Active; Price: 0.18; Series: C; Size / Dimension: 0.079" L x 0.049" W (2.00mm x 1.25mm); Supplier 1: DigiKey; Supplier Part Number 1: 445-11510-1-ND; Temperature Coefficient: JB; Thickness (Max): 0.057" (1.45mm); Voltage - Rated: 50V
FB1 FB2 = BLM31SN500SZ1L: FERRITE BEAD 50 OHM 1206 1LN; Manufacturer: Murata Electronics; Current Rating (Max): 12A; DC Resistance (DCR) (Max): 1.6mOhm; Filter Type: Power Line; Number of Lines: 1; Part Number: BLM31SN500SZ1L; ComponentLink1Description: Datasheet; ComponentLink1URL: https://www.murata.com/en-us/products/productdata/8796751200286/QNFA9115.pdf; ComponentLink2Description: DigiKey Link; ComponentLink2URL: http://digikey.com/product-detail/en/murata-electronics/BLM31SN500SZ1L/490-13270-1-ND/5881270; Device Package: 1206 (3216 Metric); Height (Max): 0.051" (1.30mm); Impedance @ Frequency: 50 Ohms @ 100MHz; LastUpdated: 21/01/2020 02:29:52; Lifecycle Status: Active; Minimum Order: 1; Mounting Type: Surface Mount; Operating Temperature: -55°C ~ 125°C; Package / Case: 1206 (3216 Metric); Packaging: TapeAndReel; PartId: 1661; Part Status: Active; Price: 0.12; Ratings: AEC-Q200; Series: EMIFIL®, BLM31; Size / Dimension: 0.126" L x 0.063" W (3.20mm x 1.60mm); Supplier 1: DigiKey; Supplier Part Number 1: 490-13270-1-ND; Value: 50 Ohms @ 100MHz
IC6 = NCP1117ST33T3G: IC REG LDO 3.3V 1A SOT223; Manufacturer: ON Semiconductor; Topology: Positive Fixed; Voltage Dropout: 1.07V @ 800mA; Voltage - Input: Up to 20V; Part Number: NCP1117ST33T3G; PartId: 7932; Supplier 1: Digi-Key; Supplier Part Number 1: NCP1117ST33T3GOSTR-ND; ComponentLink1Description: Datasheet; ComponentLink1URL: http://www.onsemi.com/pub_link/Collateral/NCP1117-D.PDF; ComponentLink2Description: Digi-Key Listing; ComponentLink2URL: http://www.digikey.ca/product-detail/en/NCP1117ST33T3G/NCP1117ST33T3GOSTR-ND/1749063; Price: 0.2342; Device Package: TO-261-4, TO-261AA; Voltage - Output: 3.3V; Current - Limit (Min): 1A; Operating Temperature: 0C ~ 125C
J2 = C168698: USB 3.1 TYPE C MID MOUNT HYBRID; Manufacturer: Jing Extension; Number Of Positions: 24; Part Number: C168698; PartId: 9702; Supplier 1: LCSC; Supplier Part Number 1: C168698; ComponentLink1Description: Datasheet; ComponentLink1URL: https://datasheet.lcsc.com/szlcsc/1811131841_Jing-Extension-of-the-Electronic-Co-C168698_C168698.pdf,; ComponentLink2Description: Alternative; ComponentLink2URL: https://gct.co/connector/usb4055; Type: USB - C; Series: USB 3.1, Superspeed+
P4 = Header 3: Header, 3-Pin; LatestRevisionDate: 17-Jul-2002; LatestRevisionNote: Re-released for DXP Platform.; Publisher: Altium Limited
R23 = RC0805FR-073R48L: RES SMD 3.48 OHM 1% 1/8W 0805; Manufacturer: Yageo; Power (Watts): 0.125W, 1/8W; Temperature Coefficient: ±200ppm/°C; Part Number: RC0805FR-073R48L; Value: 3.48 Ohms; ComponentLink1Description: Datasheet; ComponentLink1URL: https://www.yageo.com/upload/media/product/productsearch/datasheet/rchip/PYu-RC_Group_51_RoHS_L_10.pdf; ComponentLink2Description: DigiKey Link; ComponentLink2URL: http://digikey.com/product-detail/en/yageo/RC0805FR-073R48L/311-3.48CRCT-ND/730768; Composition: Thick Film; Device Package: 0805 (2012 Metric); Features: Moisture Resistant; Height - Seated (Max): 0.024" (0.60mm); LastUpdated: 21/01/2020 01:49:21; Lifecycle Status: Active; Minimum Order: 1; Number of Terminations: 2; Operating Temperature: -55°C ~ 155°C; Package / Case: 0805 (2012 Metric); Packaging: TapeAndReel; PartId: 29394; Part Status: Active; Price: 0.01; Resistance: 3.48 Ohms; Series: RC; Size / Dimension: 0.079" L x 0.049" W (2.00mm x 1.25mm); Supplier 1: DigiKey; Supplier Part Number 1: 311-3.48CRCT-ND; Supplier Device Package: 0805; Tolerance: ±1%
R24 = CRCW060310K0JNEA: as R2 on sheet [2] MCU; Part Number: CRCW060310K0JNEA; Value: 10 kOhms; ComponentLink1Description: Datasheet; ComponentLink1URL: http://www.vishay.com/docs/20035/dcrcwe3.pdf; ComponentLink2Description: DigiKey Link; ComponentLink2URL: http://digikey.com/product-detail/en/vishay-dale/CRCW060310K0JNEA/541-10KGCT-ND/1179393; Composition: Thick Film; Device Package: 0603 (1608 Metric); Features: Automotive AEC-Q200; Height - Seated (Max): 0.020" (0.50mm); LastUpdated: 21/01/2020 00:24:50; Lifecycle Status: Active; Minimum Order: 1; Number of Terminations: 2; Operating Temperature: -55°C ~ 155°C; Package / Case: 0603 (1608 Metric); Packaging: CutTape; PartId: 5216; Part Status: Active; Price: 0.10; Ratings: AEC-Q200; Resistance: 10 kOhms; Series: CRCW; Size / Dimension: 0.063" L x 0.033" W (1.60mm x 0.85mm); Supplier 1: DigiKey; Supplier Part Number 1: 541-10KGCT-ND; Supplier Device Package: 0603; Tolerance: ±5%

## Sheet [7] Display.SchDoc
size A3; Author: Caner ALP; Organization: ALP Electronics; Address1: Axel Oxenstiernas; Address2: Västerås; Address3: 72478; Address4: Sweden; DocumentNumber: 7; SheetNumber: 7; SheetTotal: 7
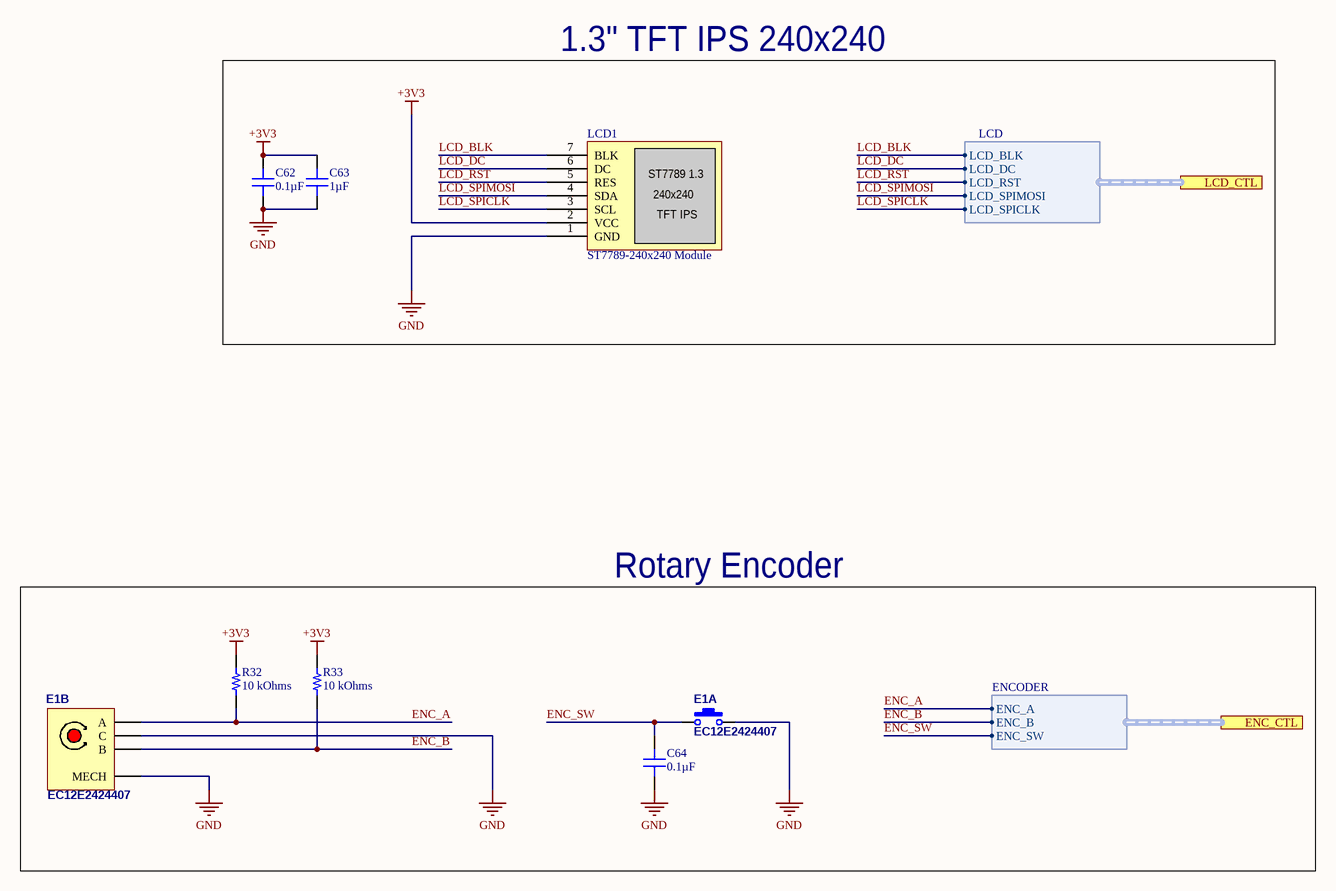
[diagram p3: [7] Display.SchDoc]

### Parts
C62  0.1µF  [CAP 0603_1608]
C63  1µF  [CAP 0603_1608]
C64  0.1µF  [CAP 0603_1608]
E1  EC12E2424407  [EC12E242]  (parts A,B of 2)
LCD1  ST7789-240x240 Module  [1.3 TFT IPS - Module]
R32  10 kOhms  [RES 0603_1608]
R33  10 kOhms  [RES 0603_1608]

### Blocks framed on the sheet
1.3" TFT IPS 240x240: C62 C63 LCD1
Rotary Encoder: C64 E1 R32 R33

### Ports
ENC_CTL (harness ENCODER), LCD_CTL (harness LCD)

### Harnesses
LCD: LCD_BLK, LCD_DC, LCD_RST, LCD_SPIMOSI, LCD_SPICLK
ENCODER: ENC_A, ENC_B, ENC_SW

### Nets
+3V3: C62.1 C63.2 LCD1.2(VCC) R32.2 R33.2
GND: C62.2 C63.1 C64.2 E1.C E1.M(MECH) E1.S2 LCD1.1(GND)
ENC_A: E1.A R32.1 ; port ENC_CTL.ENC_A
ENC_B: E1.B R33.1 ; port ENC_CTL.ENC_B
ENC_SW: C64.1 E1.S1 ; port ENC_CTL.ENC_SW
LCD_BLK: LCD1.7(BLK) ; port LCD_CTL.LCD_BLK
LCD_DC: LCD1.6(DC) ; port LCD_CTL.LCD_DC
LCD_RST: LCD1.5(RES) ; port LCD_CTL.LCD_RST
LCD_SPICLK: LCD1.3(SCL) ; port LCD_CTL.LCD_SPICLK
LCD_SPIMOSI: LCD1.4(SDA) ; port LCD_CTL.LCD_SPIMOSI

### Notes on the sheet
- Title
- Size:
- Project
- A3
- Revision:
- Date:
- Sheet
- of
- (in symbol ST7789-240x240 Module) ST7789 1.3; 240x240; TFT IPS

### Library data of the parts
C62 C64 = 0603BB104K500NGT: as C6 on sheet [2] MCU; Part Number: 0603BB104K500NGT; Value: 0.1µF; Applications: General Purpose; Capacitance: 0.1µF; ComponentLink1Description: Datasheet; ComponentLink1URL: https://www.knowlescapacitors.com/getattachment/6c8d48ef-fc2b-4752-ae2c-ce6c208de0c4/High-Capacitance-Chip.aspx; ComponentLink2Description: DigiKey Link; ComponentLink2URL: http://digikey.com/product-detail/en/knowles-novacap/0603BB104K500NGT/1763-1146-1-ND/7304094; Device Package: 0603 (1608 Metric); Features: Gold Flash Termination; LastUpdated: 21/01/2020 00:02:02; Lifecycle Status: Active; Minimum Order: 1; Mounting Type: Surface Mount, MLCC; Operating Temperature: -55°C ~ 125°C; Package / Case: 0603 (1608 Metric); Packaging: TapeAndReel; PartId: 7006; Part Status: Active; Price: 0.56; Series: -; Size / Dimension: 0.060" L x 0.030" W (1.52mm x 0.76mm); Supplier 1: DigiKey; Supplier Part Number 1: 1763-1146-1-ND; Temperature Coefficient: X7R; Thickness (Max): 0.035" (0.89mm); Voltage - Rated: 50V
C63 = 0603BB105K160YT: as C7 on sheet [2] MCU; Part Number: 0603BB105K160YT; Value: 1µF; Applications: General Purpose; Capacitance: 1µF; ComponentLink1Description: Datasheet; ComponentLink1URL: https://www.knowlescapacitors.com/getattachment/6c8d48ef-fc2b-4752-ae2c-ce6c208de0c4/High-Capacitance-Chip.aspx; ComponentLink2Description: DigiKey Link; ComponentLink2URL: http://digikey.com/product-detail/en/knowles-novacap/0603BB105K160YT/1763-1175-1-ND/7304294; Device Package: 0603 (1608 Metric); LastUpdated: 21/01/2020 00:02:02; Lifecycle Status: Active; Minimum Order: 1; Mounting Type: Surface Mount, MLCC; Operating Temperature: -55°C ~ 125°C; Package / Case: 0603 (1608 Metric); Packaging: TapeAndReel; PartId: 6996; Part Status: Active; Price: 0.51; Series: -; Size / Dimension: 0.060" L x 0.030" W (1.52mm x 0.76mm); Supplier 1: DigiKey; Supplier Part Number 1: 1763-1175-1-ND; Temperature Coefficient: X7R; Thickness (Max): 0.035" (0.89mm); Voltage - Rated: 16V
E1 = EC12E2424407: Alps 20mm, 24PPR+SW Encoder
LCD1 = ST7789-240x240 Module: LCD TFT IPS 1.3" 240x240; Part Number: ST7789-240x240 Module; PartId: 7912
R32 R33 = CRCW060310K0JNEA: as R2 on sheet [2] MCU; Part Number: CRCW060310K0JNEA; Value: 10 kOhms; ComponentLink1Description: Datasheet; ComponentLink1URL: http://www.vishay.com/docs/20035/dcrcwe3.pdf; ComponentLink2Description: DigiKey Link; ComponentLink2URL: http://digikey.com/product-detail/en/vishay-dale/CRCW060310K0JNEA/541-10KGCT-ND/1179393; Composition: Thick Film; Device Package: 0603 (1608 Metric); Features: Automotive AEC-Q200; Height - Seated (Max): 0.020" (0.50mm); LastUpdated: 21/01/2020 00:24:50; Lifecycle Status: Active; Minimum Order: 1; Number of Terminations: 2; Operating Temperature: -55°C ~ 155°C; Package / Case: 0603 (1608 Metric); Packaging: CutTape; PartId: 5216; Part Status: Active; Price: 0.10; Ratings: AEC-Q200; Resistance: 10 kOhms; Series: CRCW; Size / Dimension: 0.063" L x 0.033" W (1.60mm x 0.85mm); Supplier 1: DigiKey; Supplier Part Number 1: 541-10KGCT-ND; Supplier Device Package: 0603; Tolerance: ±5%